# Altium schematic sheet BMS-FETs.SchDoc
size A3; SheetNumber: 2; SheetTotal: 3
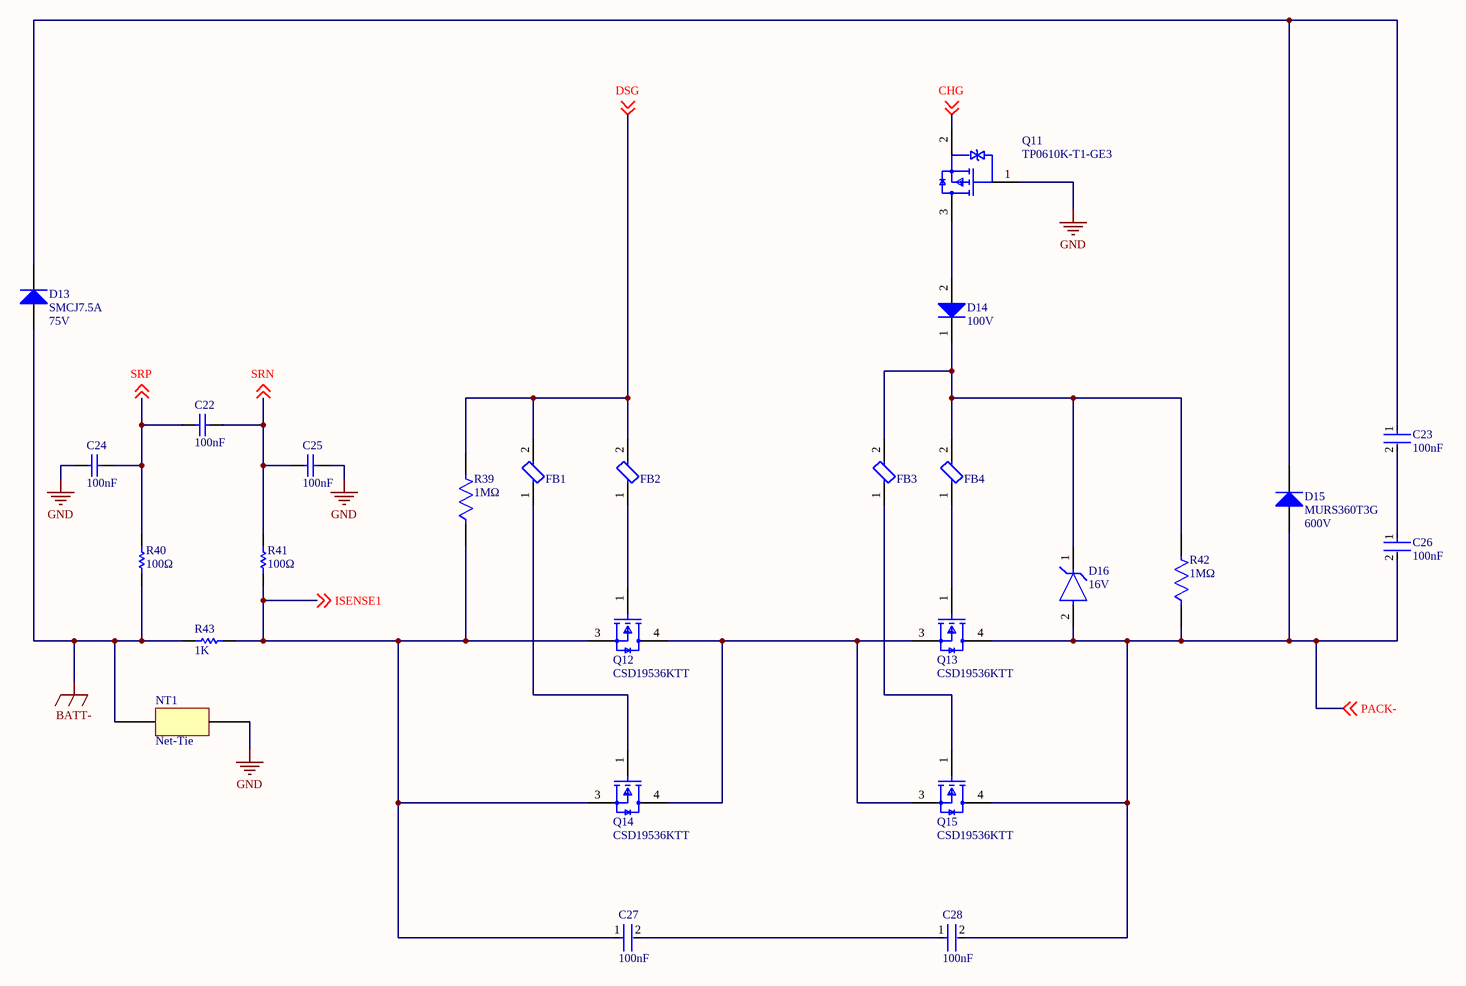
[diagram p0: BMS-FETs.SchDoc]

## Parts
C22  Capacitance: 100nF  [WCAP-CSGP_0603_L1.6W0.8H0.8_Reflow]  (hidden comment: 885012206095)
C23  Capacitance: 100nF  [FP-GRM188-0_1-e0_2_0_5-IPC_A]  (hidden comment: GRM188R72A104KA35D)
C24  Capacitance: 100nF  [WCAP-CSGP_0603_L1.6W0.8H0.8_Reflow]  (hidden comment: 885012206095)
C25  Capacitance: 100nF  [WCAP-CSGP_0603_L1.6W0.8H0.8_Reflow]  (hidden comment: 885012206095)
C26  Capacitance: 100nF  [FP-GRM188-0_1-e0_2_0_5-IPC_A]  (hidden comment: GRM188R72A104KA35D)
C27  Capacitance: 100nF  [FP-GRM188-0_1-e0_2_0_5-IPC_A]  (hidden comment: GRM188R72A104KA35D)
C28  Capacitance: 100nF  [FP-GRM188-0_1-e0_2_0_5-IPC_A]  (hidden comment: GRM188R72A104KA35D)
D13  SMCJ7.5A  Rep Pk Reverse Voltage-Max: 75V  [DIOM7959X262N]
D14  Voltage Rating (DC): 100V  [ONSC-SOD-123-2-425-04_V]  (hidden comment: MMSD914T1G)
D15  MURS360T3G  Rep Pk Reverse Voltage-Max: 600V  [DIOM8059X261N]
D16  Reference Voltage-Nom: 16V  [SOD3716X145N]  (hidden comment: MMSZ5246B-7-F)
FB1  BLM18SG221TN1D  [FP-BLM18-0_15-t0_5-IPC_C]  (value not drawn)
FB2  BLM18SG221TN1D  [FP-BLM18-0_15-t0_5-IPC_C]  (value not drawn)
FB3  BLM18SG221TN1D  [FP-BLM18-0_15-t0_5-IPC_C]  (value not drawn)
FB4  BLM18SG221TN1D  [FP-BLM18-0_15-t0_5-IPC_C]  (value not drawn)
NT1  Net-Tie
Q11  TP0610K-T1-GE3  [FP-S-03946-IPC_C]
Q12  CSD19536KTT  [FP-CSD19536KTT-MFG]
Q13  CSD19536KTT  [FP-CSD19536KTT-MFG]
Q14  CSD19536KTT  [FP-CSD19536KTT-MFG]
Q15  CSD19536KTT  [FP-CSD19536KTT-MFG]
R39  Resistance: 1MΩ  [FP-CRCW0603-e3-MFG]  (hidden comment: CRCW06031M00FKEA)
R40  Resistance: 100Ω  [RESC2013X50X30ML20T20]  (hidden comment: CRCW0805100RFKEA)
R41  Resistance: 100Ω  [RESC2013X50X30ML20T20]  (hidden comment: CRCW0805100RFKEA)
R42  Resistance: 1MΩ  [FP-CRCW0603-e3-MFG]  (hidden comment: CRCW06031M00FKEA)
R43  value 1K  (hidden comment: Resistor)

## Nets
BATT-: D13.1(A) NT1.31 R40.1 R43.1
GND: C24.1 C25.2 NT1.32 Q11.1(G)
CHG: Q11.2(S) ; off-sheet CHG
DSG: FB1.2 FB2.2 R39.2 ; off-sheet DSG
ISENSE1: C27.1 Q12.3(Source) Q14.3(Source) R39.1 R41.1 R43.2 ; off-sheet ISENSE1
PACK-: C26.2 C28.2 D15.1(A) D16.2(A) Q13.4(Drain) Q15.4(Drain) R42.1 ; off-sheet PACK-
SRN: C22.2 C25.1 R41.2 ; off-sheet SRN
SRP: C22.1 C24.2 R40.2 ; off-sheet SRP
NetC23_1: C23.1 D13.2(K) D15.2(K)
NetC23_2: C23.2 C26.1
NetC27_2: C27.2 C28.1
NetD14_1: D14.1(K) D16.1(C) FB3.2 FB4.2 R42.2
NetD14_2: D14.2(A) Q11.3(D)
NetFB1_1: FB1.1 Q14.1(Gate)
NetFB2_1: FB2.1 Q12.1(Gate)
NetFB3_1: FB3.1 Q15.1(Gate)
NetFB4_1: FB4.1 Q13.1(Gate)
NetQ12_4: Q12.4(Drain) Q13.3(Source) Q14.4(Drain) Q15.3(Source)

## Library data of the parts
C22 C24 C25 = CMP-207839-000004-2: CAP CER 0.1UF 50V X7R 0603; NexarPartId: 53914804; Tolerance: 10%; Insulation Resistance: 5GΩ; Material: Ceramic; RoHS: Compliant; Voltage Rating (DC): 50V; Case Code (Metric): 1608; Case Code (Imperial): 0603; Mount: Surface Mount; Dielectric: X7R; Length: 1.6mm; Packaging: Cut Tape (CT); Max Operating Temperature: 125°C; Case/Package: 0603; Voltage Rating: 50V; Thickness: 939.8µm; Min Operating Temperature: -55°C; Width: 800µm; Height: 800µm; REACH SVHC: Unknown; Supplier 1: Mouser; Supplier Part Number 1: 710-885012206095; Supplier 2: Digikey; Supplier Part Number 2: 732-8013-1-ND
C23 C26-C28 = CMP-1035-02595-8: Chip Multilayer Ceramic Capacitors for General Purpose, 0603, 0.10uF, X7R, 15%, 10%, 100V; Voltage Rating (DC): 100V; Material: Ceramic; Packaging: Tape and Reel; Dielectric: X7R; Case Code (Imperial): 0603; Package Quantity: 1; Height: 0.8mm; Weight: 0.000222oz; Min Operating Temperature: -55°C; Depth: 0.8mm; Mount: Surface Mount; Thickness: 0.035inch; Voltage: 100V; REACH SVHC: No SVHC; Case/Package: 0603; Voltage Rating: 100V; Width: 0.8mm; Tolerance: 10%; Lead Free: Lead Free; Case Code (Metric): 1608; Radiation Hardening: No; Max Operating Temperature: 125°C; Termination: SMD/SMT; Length: 1.6mm; Supplier 1: Mouser; Supplier Part Number 1: 81-GRM188R72A104KA35; Supplier 2: Digikey; Supplier Part Number 2: 490-3285-1-ND
D13 = SMCJ7.5A: Trans Voltage Suppressor Diode, 1500W, 75V V(RWM), Unidirectional, 1 Element, Silicon, DO-214AB; Manufacturer: Littelfuse; Package Body Material: Plastic; Max Breakdown Voltage: 92.1V; Min Breakdown Voltage: 83.3V; Breakdown Voltage-Nom: 87.7V; Non-rep Peak Rev Power Dis-Max: 1.5kW; Number of Elements: 1; Clamping Voltage-Max: 121V; Time @ Peak Reflow Temperature-Max (s): 40s; Qualification Status: Not Qualified; Supplier: Arrow Electronics; Supplier Part Number: SMCJ7.5A; Manufacturer Part Number: SMCJ7.5A; RoHS: Yes; Category: TVS Diodes; Stock: 1; Pricing: 1=0.1926 (USD); Pins: 2; Diode Element Material: SILICON; Package Shape: Rectangular; Terminal Finish: Tin; Min Operating Temperature: -65°C; Max Operating Temperature: 150°C; Polarity: Unidirectional; Diode Type: TRANS VOLTAGE SUPPRESSOR; JESD-30 Code: R-PDSO-C2; Moisture Sensitivity Level: 1; Package Style: SMALL OUTLINEMeter; Surface Mount: Yes; Technology: AVALANCHE; Terminal Form: C BEND; Terminal Position: DUAL; JESD-609 Code: e3; Peak Reflow Temperature (Cel): 260°C; RoHS Compliant: Yes; Reach SVHC Compliant: No; JEDEC-95 Code: DO-214AB; ComponentLink1URL: https://datasheet.ciiva.com:443/pdfs/VipMasterIC/IC/LFSI/LFSI-S-A0001360024/LFSI-S-A0001360024-1.pdf?src-supplier=IHS+Markit; ComponentLink1Description: https://datasheet.ciiva.com:443/pdfs/VipMasterIC/IC/LFSI/LFSI-S-A0001360024/LFSI-S-A0001360024-1.pdf?src-supplier=IHS+Markit; ComponentLink2URL: https://datasheet.ciiva.com/332/littelfuse-tvs-diode-smcj-datasheet-pdf-332078.pdf?src-supplier=Digikey; ComponentLink2Description: https://datasheet.ciiva.com/332/littelfuse-tvs-diode-smcj-datasheet-pdf-332078.pdf?src-supplier=Digikey; ComponentLink3URL: https://datasheet.ciiva.com/332/littelfuse-tvs-diode-smcj-datasheet-pdf-332079.pdf?src-supplier=Digikey; ComponentLink3Description: https://datasheet.ciiva.com/332/littelfuse-tvs-diode-smcj-datasheet-pdf-332079.pdf?src-supplier=Digikey; ComponentLink4URL: https://datasheet.ciiva.com/332/littelfuse-tvs-diode-smcj-datasheet-pdf-332132.pdf?src-supplier=Digikey; ComponentLink4Description: https://datasheet.ciiva.com/332/littelfuse-tvs-diode-smcj-datasheet-pdf-332132.pdf?src-supplier=Digikey; ComponentLink5URL: https://datasheet.ciiva.com/332/littelfuse-tvs-diode-smcj-datasheet-pdf-332133.pdf?src-supplier=Digikey; ComponentLink5Description: https://datasheet.ciiva.com/332/littelfuse-tvs-diode-smcj-datasheet-pdf-332133.pdf?src-supplier=Digikey; ComponentLink6URL: https://datasheet.ciiva.com/332/littelfuse-tvs-diode-smcj-datasheet-pdf-332134.pdf?src-supplier=Digikey; ComponentLink6Description: https://datasheet.ciiva.com/332/littelfuse-tvs-diode-smcj-datasheet-pdf-332134.pdf?src-supplier=Digikey; ComponentLink7URL: https://datasheet.ciiva.com/16487/littelfuse-tvs-diode-smcj-16487821.pdf?src-supplier=Future+Electronics; ComponentLink7Description: https://datasheet.ciiva.com/16487/littelfuse-tvs-diode-smcj-16487821.pdf?src-supplier=Future+Electronics; Supplier 1: Mouser; Supplier Part Number 1: 576-SMCJ7.5A
D14 = CMP-1054-00050-1: Rectifier Diode, 1 Phase, 1 Element, 0.2A, 100V V(RRM), Silicon; Manufacturer: On Semiconductor; Configuration: Single; trr Max (ns): 4; IF Max (A): 0.2; Packing: Tape and Reel; Package Body Material: Plastic; Forward Voltage: 1V; Non-rep Pk Forward Current-Max: 500mA; Number of Elements: 1; Max Output current: 200mA; Max Power Dissipation: 425mW; Reverse Recovery Time-Max: 0.004us; Time @ Peak Reflow Temperature-Max (s): 40s; Qualification Status: Not Qualified; ComponentLink2URL: http://www.onsemi.com/pub_link/Collateral/MMSD914T1-D.PDF; PackageVersion: Rev. G, 10/2009; PackageReference: SOD-123-2-425-04; DatasheetVersion: Rev. 11; PackageDescription: 2-Pin SOD, Body 1.6 x 2.69 mm; ComponentLink3Description: Package Specification; ComponentLink2Description: Datasheet; ComponentLink3URL: http://www.onsemi.com/pub_link/Collateral/425-04.PDF; ComponentLink1URL: http://www.onsemi.com/; RoHS: TRUE; Mounting Technology: Surface Mount; ComponentLink1Description: Manufacturer URL; PartNumber: MMSD914T1G; Supplier: Future Electronics; Supplier Part Number: 5827118; Manufacturer Part Number: MMSD914T1G; Category: Rectifier Diodes; Stock: 801000; Pricing: 3000=0.0143, 12000=0.0136, 30000=0.0132, 75000=0.0129, 120000=0.0123 (USD); Pins: 2; Diode Element Material: SILICON; Package Shape: Rectangular; Terminal Finish: Tin; Min Operating Temperature: -55°C; Max Operating Temperature: 150°C; JESD-609 Code: e3; Diode Type: RECTIFIER; JESD-30 Code: R-PDSO-G2; Moisture Sensitivity Level: 1; Package Style: SMALL OUTLINEMeter; Rep Pk Reverse Voltage-Max: 100V; Surface Mount: Yes; Terminal Form: Gull Wing; Terminal Position: DUAL; Peak Reflow Temperature (Cel): 260°C; Reach SVHC Compliant: Yes; RoHS Compliant: Yes; ComponentLink4URL: https://datasheet.ciiva.com:443/pdfs/VipMasterIC/IC/ONSM/ONSMS25591/ONSMS25591-1.pdf?src-supplier=IHS+Markit; ComponentLink4Description: https://datasheet.ciiva.com:443/pdfs/VipMasterIC/IC/ONSM/ONSMS25591/ONSMS25591-1.pdf?src-supplier=IHS+Markit; ComponentLink5URL: https://datasheet.ciiva.com/927/mmsd914t1-d-927475.pdf?src-supplier=Avnet; ComponentLink5Description: https://datasheet.ciiva.com/927/mmsd914t1-d-927475.pdf?src-supplier=Avnet; ComponentLink6URL: https://datasheet.ciiva.com/915/mmsd914t1-d-915389.pdf?src-supplier=Digikey; ComponentLink6Description: https://datasheet.ciiva.com/915/mmsd914t1-d-915389.pdf?src-supplier=Digikey; ComponentLink7URL: https://datasheet.ciiva.com/915/mmsd914t1-d-915390.pdf?src-supplier=Digikey; ComponentLink7Description: https://datasheet.ciiva.com/915/mmsd914t1-d-915390.pdf?src-supplier=Digikey; ComponentLink8URL: https://datasheet.ciiva.com/915/mmsd914t1-d-915391.pdf?src-supplier=Digikey; ComponentLink8Description: https://datasheet.ciiva.com/915/mmsd914t1-d-915391.pdf?src-supplier=Digikey; ComponentLink9URL: https://datasheet.ciiva.com/8299/mmsd914t1-d-8299885.pdf?src-supplier=Avnet; ComponentLink9Description: https://datasheet.ciiva.com/8299/mmsd914t1-d-8299885.pdf?src-supplier=Avnet; Supplier 1: Mouser; Supplier Part Number 1: 863-MMSD914T1G; Supplier 2: Digikey; Supplier Part Number 2: MMSD914T1GOSCT-ND
D15 = MURS360T3G: Rectifier Diode, 1 Phase, 1 Element, 4A, 600V V(RRM), Silicon; Manufacturer: ON Semiconductor; Package Body Material: Plastic; Application(s): HIGH VOLTAGE ULTRA FAST RECOVERY POWER; Forward Voltage: 1.28V; Non-rep Pk Forward Current-Max: 75A; Number of Elements: 1; Time @ Peak Reflow Temperature-Max (s): 40s; Additional Feature: FREE WHEELING DIODE; Reverse Recovery Time-Max: 0.075us; Qualification Status: Not Qualified; Supplier: Future Electronics; Supplier Part Number: 6157887; Manufacturer Part Number: MURS360T3G; RoHS: Yes; Category: Rectifier Diodes; Stock: 77500; Pricing: 2500=0.186, 5000=0.183, 7500=0.18, 10000=0.179, 12500=0.174 (USD); Pins: 2; Diode Element Material: SILICON; Package Shape: Rectangular; Terminal Finish: Tin; Min Operating Temperature: -65°C; Max Operating Temperature: 175°C; JESD-609 Code: e3; Diode Type: RECTIFIER; JESD-30 Code: R-PDSO-C2; Moisture Sensitivity Level: 1; Number of Phases: 1; Max Output current: 4A; Package Style: SMALL OUTLINEMeter; Peak Reflow Temperature (Cel): 260°C; Surface Mount: Yes; Terminal Form: C BEND; Terminal Position: DUAL; RoHS Compliant: Yes; Reach SVHC Compliant: No; ComponentLink1URL: https://datasheet.ciiva.com:443/pdfs/VipMasterIC/IC/ONSM/ONSM-S-A0003142818/ONSM-S-A0003142818-1.pdf?src-supplier=IHS+Markit; ComponentLink1Description: https://datasheet.ciiva.com:443/pdfs/VipMasterIC/IC/ONSM/ONSM-S-A0003142818/ONSM-S-A0003142818-1.pdf?src-supplier=IHS+Markit; Supplier 1: Mouser; Supplier Part Number 1: 863-MURS360T3G
D16 = MMSZ5246B-7-F: Zener Diode, 16V V(Z), 5%, 0.37W, Silicon, Unidirectional; Manufacturer: Diodes; Package Body Material: Plastic; Additional Feature: HIGH RELIABILITY; Dynamic Impedance-Max: 17R; Number of Elements: 1; Max Power Dissipation: 370mW; Time @ Peak Reflow Temperature-Max (s): 40s; Test Current: 7.8mA; Qualification Status: Not Qualified; Supplier: Future Electronics; Supplier Part Number: 8043663; Manufacturer Part Number: MMSZ5246B-7-F; RoHS: Yes; Category: Zener Diodes; Stock: 1230000; Pricing: 3000=0.022, 12000=0.021, 30000=0.0204, 75000=0.0198, 120000=0.019 (USD); Pins: 2; Diode Element Material: SILICON; Package Shape: Rectangular; Terminal Finish: Tin; Min Operating Temperature: -65°C; Max Operating Temperature: 150°C; JESD-609 Code: e3; Polarity: Unidirectional; Diode Type: ZENER; JESD-30 Code: R-PDSO-G2; Moisture Sensitivity Level: 1; Package Style: SMALL OUTLINEMeter; Peak Reflow Temperature (Cel): 260°C; Surface Mount: Yes; Technology: ZENER; Terminal Form: Gull Wing; Terminal Position: DUAL; Voltage Tol-Max: 5%; Reach SVHC Compliant: Yes; RoHS Compliant: Yes; ComponentLink1URL: https://datasheet.ciiva.com:443/pdfs/VipMasterIC/IC/DIOD/DIOD-S-A0003550771/DIOD-S-A0003550771-1.pdf?src-supplier=IHS+Markit; ComponentLink1Description: https://datasheet.ciiva.com:443/pdfs/VipMasterIC/IC/DIOD/DIOD-S-A0003550771/DIOD-S-A0003550771-1.pdf?src-supplier=IHS+Markit; ComponentLink2URL: https://datasheet.ciiva.com/34302/1591156-34302610.pdf?src-supplier=Jameco; ComponentLink2Description: https://datasheet.ciiva.com/34302/1591156-34302610.pdf?src-supplier=Jameco; Supplier 1: Mouser; Supplier Part Number 1: 621-MMSZ5246B-F
FB1-FB4 = CMP-0686-00596-3: Chip Ferrite Bead, 0603, 220Ω @ 100MHz, 25%, 0.04Ω, 2.5A; Impedance: 220R; DC Resistance-Max: 40mR; Number of Circuits: 1; Test Frequency: 100MHz; Material: Ferrite; Lead Free: Lead Free; Width: 0.8mm; Max Current Rating: 2.5A; Termination: SMD/SMT; Depth: 0.95mm; Packaging: Tape and Reel; Case Code (Metric): 1608; DC Current: 2.5A; Weight: 7.1E-05oz; Min Operating Temperature: -55°C; DC Resistance (DCR): 40mR; Max Operating Temperature: 125°C; Core Material: Ferrite; Max DC Current: 2.5A; Case/Package: 0603; REACH SVHC: No SVHC; Height: 0.8mm; Number of Pins: 2; Tolerance: 25%; RoHS Compliant: Yes; Radiation Hardening: No; Current Rating: 2.5A; Number of Lines: 1; Series: BLM18S; Case Code (Imperial): 0603; Length: 1.6mm; Package Quantity: 1; Supplier 1: Mouser; Supplier Part Number 1: 81-BLM18SG221TN1D
Q11 = CMP-02550-000326-1: MOSFET P-CH 60V 185MA SOT23-3; Nominal Vgs: -1V; Polarity: P-CHANNEL; Power Dissipation: 350mW; Element Configuration: Single; Threshold Voltage: -2V; Turn-Off Delay Time: 35ns; Turn-On Delay Time: 20ns; Gate to Source Voltage (Vgs): 20V; Number of Elements: 1; Drain to Source Voltage (Vdss): -60V; Input Capacitance: 155pF; Rds On Max: 190mR; Continuous Drain Current (ID): -185mA; Drain to Source Resistance: 10R; Max Operating Temperature: 150°C; Height: 1.02mm; Weight: 0.050717oz; Radiation Hardening: No; Package Quantity: 1; Min Operating Temperature: -55°C; Packaging: Tape and Reel; Case/Package: SOT-23-3; Width: 1.4mm; Mount: Surface Mount; Series: TrenchFET®; Length: 3.04mm; Max Power Dissipation: 350mW; RoHS Compliant: Yes; Drain to Source Breakdown Voltage: -60V; Number of Pins: 3; Lead Free: Lead Free; Number of Channels: 1; Supplier 1: Mouser; Supplier Part Number 1: 781-TP0610K-T1-GE3
Q12-Q15 = CMP-04962-000010-1: MOSFET N-CH 100V 200A TO263; Manufacturer: Texas Instruments; Gate Charge At Vgs: 118nC @ 10V; Threshold Vgs Max: 3.2V; Depletion Mode: False; Turn Off Delay Time: 32ns; Rthja Max: 62°C/W; Typ Forward Diode Voltage: 0.9V; Max Forward Diode Voltage: 1.1V; Reverse Recovery Time: 103ns; Number Of Channels: 1; Input Capacitace At Vds: 9250pF @ 50V; Reverse Recovery Charge: 548nC; Threshold Vgs Min: 2.1V; Drain To Source Resistance: 2mΩ; Transconductance: 329S; Power Dissipation: 375W; Gate To Source Voltage: 20V; Turn On Delay Time: 13ns; Max Junction Temp: +175°C; Standoff Height: 0mm; Pulse Drain Current: 400A; Digikey Description: MOSFET N-CH 100V 200A TO263; RoHS: TRUE; Lead Free: Yes; Drain To Source Voltage: 100V; Device Class L1: Discrete Semiconductors; Temperature Range Low: -55°C; Mouser Description: CSD19536KTT 100 V N-Channel NexFET? Power MOSFET 3-DDPAK/TO-263; Number Of N Channels: 1; Temperature Range High: +175°C; Temperature: -55°C to +175°C; Package: 0; ComponentLink2URL: http://www.ti.com/lit/ds/symlink/csd19536ktt.pdf; Height: 4.95mm; Automotive: No; Continuous Drain Current: 200A; Manufacturer Part Number: CSD19536KTT; Device Class L3: MOSFETs; Drain To Source Breakdown Voltage: 100V; ComponentLink2Description: Datasheet; Category: Trans; Device Class L2: Transistors; Octopart: https://octopart.com/csd19536ktt-texas+instruments-57155051; Supplier 1: Mouser; Supplier Part Number 1: 595-CSD19536KTTT
R39 R42 = CMP-2000-03013-2: RES Thick Film, 1MΩ, 1%, 0.1W, 100ppm/°C, 0603; Max Power Dissipation: 100mW; Voltage Rating (DC): 75V; Depth: 0.85mm; Max Operating Temperature: 155°C; Length: 1.55mm; Power Rating: 100mW; Military Standard: Not; Features: Automotive AEC-Q200; Min Operating Temperature: -55°C; Number of Pins: 2; Mount: Surface Mount; Package Quantity: 10; Packaging: Tape and Reel; Height: 0.45mm; Radiation Hardening: No; Case Code (Metric): 1608; Temperature Coefficient: 100ppm/°C; Width: 0.85mm; Composition: Thick Film; Termination: SMD/SMT; Tolerance: 1%; Number of Terminations: 2; Lead Free: Lead Free; Contact Plating: Tin; Case/Package: 0603; Weight: 7.1E-05oz; Voltage Rating: 75V; Case Code (Imperial): 0603
R40 R41 = CMP-2001-04901-1: Manufacturer: Vishay Dale; Part Number: CRCW0805100RFKEA; Supplier 1: Digikey; Supplier Part Number 1: 541-100CCT-ND
R43 = Resistor: TC1: 0; SimulationGenericComponent: True; TC2: 0